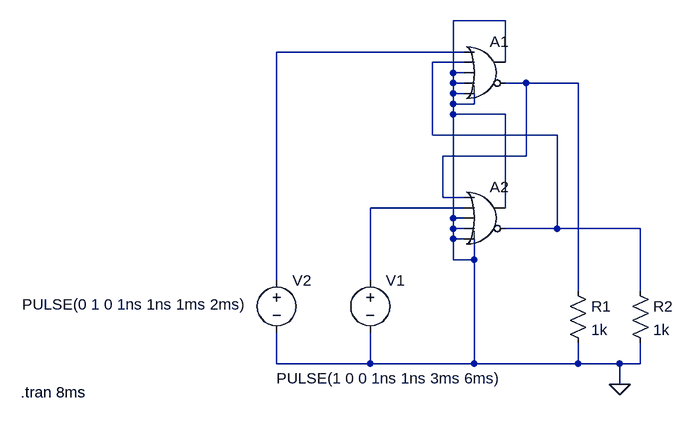
[diagram p0: schematic simulate_auto_manula_resets.asc]
simulate_auto_manula_resets.asc, the LTspice schematic file:
Version 4
SHEET 1 880 680
WIRE 128 -64 48 -64
WIRE 64 -16 -224 -16
WIRE 64 0 16 0
WIRE 128 0 128 -64
WIRE 48 16 48 -64
WIRE 64 16 48 16
WIRE 48 32 48 16
WIRE 64 32 48 32
WIRE 160 32 128 32
WIRE 240 32 160 32
WIRE 48 48 48 32
WIRE 64 48 48 48
WIRE 48 64 48 48
WIRE 80 64 80 48
WIRE 80 64 48 64
WIRE 48 80 48 64
WIRE 128 80 48 80
WIRE 16 112 16 0
WIRE 208 112 16 112
WIRE 160 144 160 32
WIRE 160 144 32 144
WIRE 32 208 32 144
WIRE 64 208 32 208
WIRE 64 224 -80 224
WIRE 128 224 128 80
WIRE 48 240 48 80
WIRE 64 240 48 240
WIRE 48 256 48 240
WIRE 64 256 48 256
WIRE 208 256 208 112
WIRE 208 256 128 256
WIRE 336 256 208 256
WIRE 48 272 48 256
WIRE 64 272 48 272
WIRE 48 304 48 272
WIRE 80 304 80 272
WIRE 80 304 48 304
WIRE -224 336 -224 -16
WIRE -80 336 -80 224
WIRE 240 352 240 32
WIRE 336 352 336 256
WIRE -224 464 -224 416
WIRE -80 464 -80 416
WIRE -80 464 -224 464
WIRE 80 464 80 304
WIRE 80 464 -80 464
WIRE 240 464 240 432
WIRE 240 464 80 464
WIRE 304 464 240 464
WIRE 336 464 336 432
WIRE 336 464 304 464
WIRE 304 496 304 464
FLAG 304 496 0
SYMBOL Digital\\or 96 -48 R0
SYMATTR InstName A1
SYMBOL Digital\\or 96 176 R0
SYMATTR InstName A2
SYMBOL voltage -80 320 R0
WINDOW 3 -144 167 Left 2
WINDOW 123 0 0 Left 0
WINDOW 39 0 0 Left 0
SYMATTR InstName V1
SYMATTR Value PULSE(1 0 0 1ns 1ns 3ms 6ms)
SYMBOL voltage -224 320 R0
WINDOW 3 -392 53 Left 2
SYMATTR InstName V2
SYMATTR Value PULSE(0 1 0 1ns 1ns 1ms 2ms)
SYMBOL res 224 336 R0
SYMATTR InstName R1
SYMATTR Value 1k
SYMBOL res 320 336 R0
SYMATTR InstName R2
SYMATTR Value 1k
TEXT -618 508 Left 2 !.tran 8ms

The netlist it stands for:
* simulate_auto_manula_resets.asc
A1 N001 N002 0 0 0 N003 0 0 OR
A2 N003 N004 0 0 0 N002 0 0 OR
V1 N004 0 PULSE(1 0 0 1ns 1ns 3ms 6ms)
V2 N001 0 PULSE(0 1 0 1ns 1ns 1ms 2ms)
R1 N003 0 1k
R2 N002 0 1k
.tran 8ms
.backanno
.end